# Altium schematic sheet GPIO_Ex.SchDoc
size A4; SheetNumber: 11; SheetTotal: 11
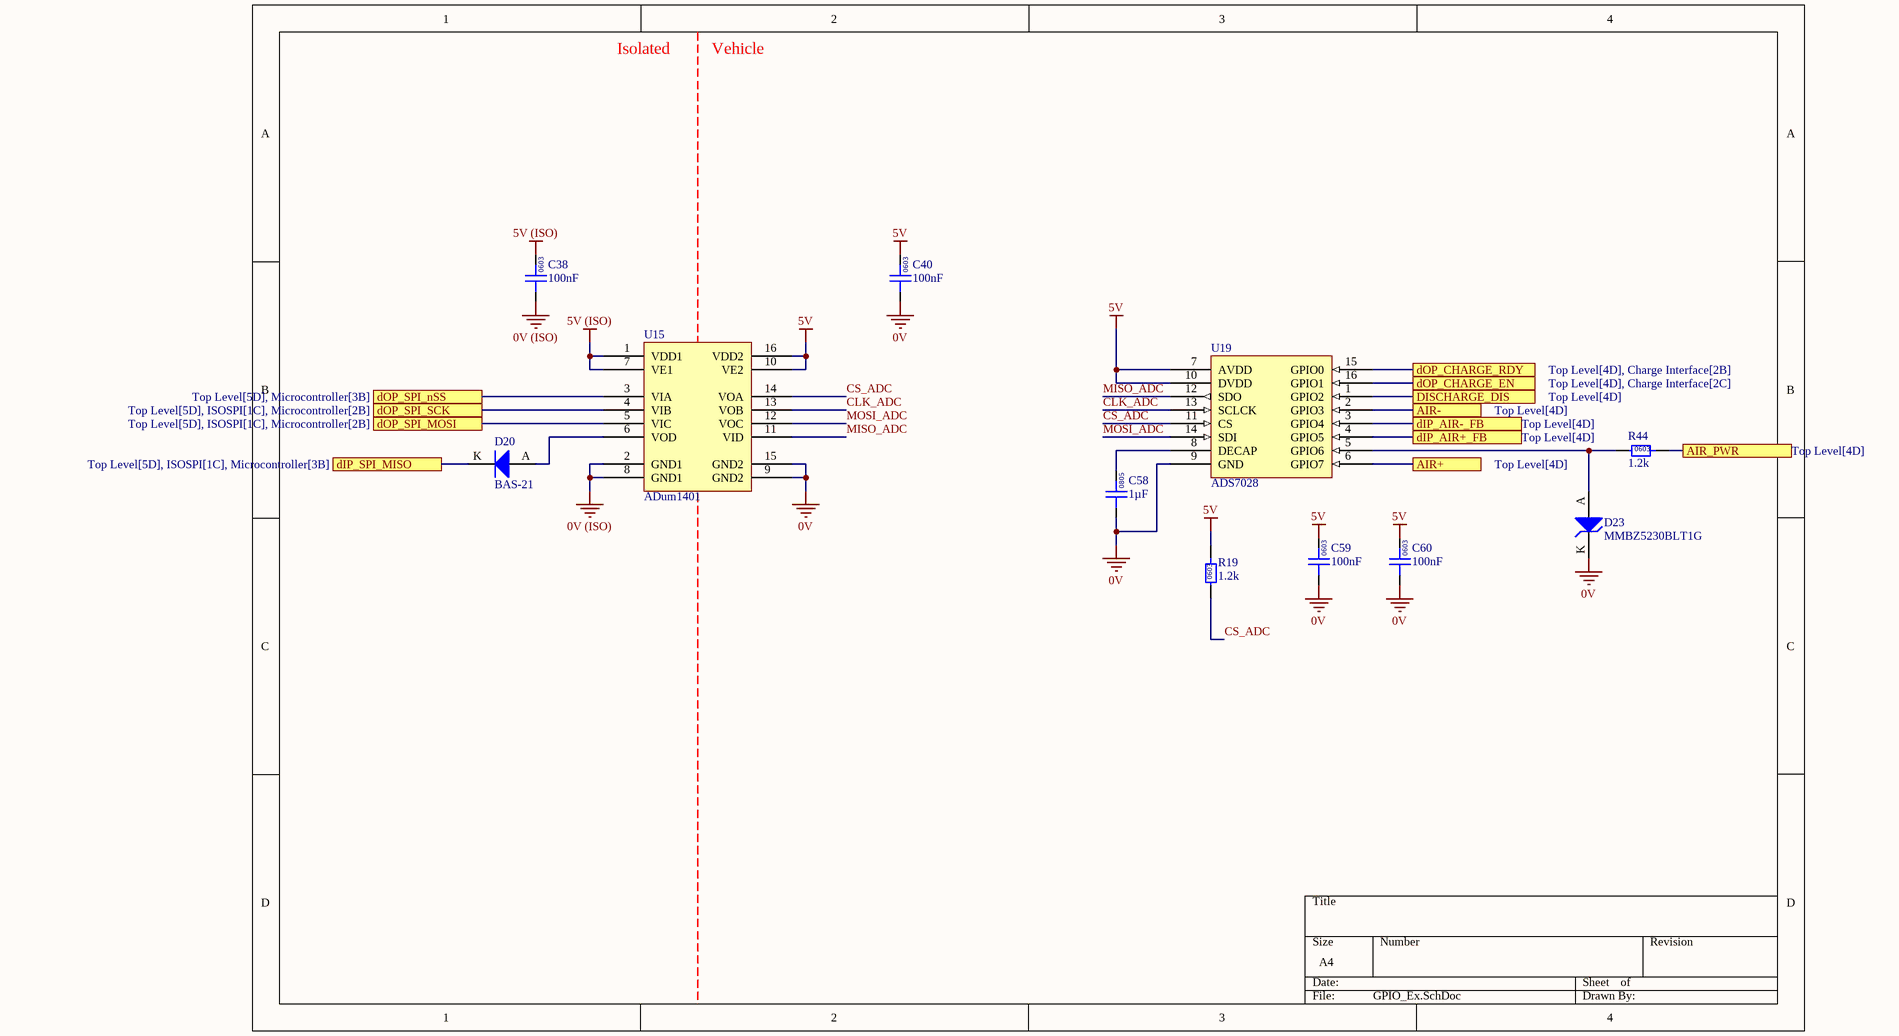
[diagram p0: GPIO_Ex.SchDoc]

## Parts
C38  100nF  [0603]
C40  100nF  [0603]
C58  1µF  [0805]
C59  100nF  [0603]
C60  100nF  [0603]
D20  BAS-21  [NEXPERIA_SOT23]
D23  MMBZ5230BLT1G  [NEXPERIA_SOT23]
R19  1.2k  [0603]
R44  1.2k  [0603]
U15  ADum1401  [AD 16-SOIC]
U19  ADS7028  [WFQN-16]

## Ports
AIR+ (see Top Level[4D]), AIR- (see Top Level[4D]), AIR_PWR (see Top Level[4D]), dIP_AIR+_FB (see Top Level[4D]), dIP_AIR-_FB (see Top Level[4D]), dIP_SPI_MISO (see Top Level[5D], ISOSPI[1C], Microcontroller[3B]), DISCHARGE_DIS (see Top Level[4D]), dOP_CHARGE_EN (see Top Level[4D], Charge Interface[2C]), dOP_CHARGE_RDY (see Top Level[4D], Charge Interface[2B]), dOP_SPI_MOSI (see Top Level[5D], ISOSPI[1C], Microcontroller[2B]), dOP_SPI_nSS (see Top Level[5D], Microcontroller[3B]), dOP_SPI_SCK (see Top Level[5D], ISOSPI[1C], Microcontroller[2B])

## Nets
0V: C40.1 C58.1 C59.1 C60.1 D23.K U15.9(GND2) U15.15(GND2) U19.9(GND)
0V (ISO): C38.1 U15.2(GND1) U15.8(GND1)
5V: C40.2 C59.2 C60.2 R19.2 U15.10(VE2) U15.16(VDD2) U19.7(AVDD) U19.10(DVDD)
5V (ISO): C38.2 U15.1(VDD1) U15.7(VE1)
AIR+: U19.6(GPIO7) ; port AIR+
AIR-: U19.2(GPIO3) ; port AIR-
AIR_PWR: R44.2 ; port AIR_PWR
CLK_ADC: U15.13(VOB) U19.13(SCLCK)
CS_ADC: R19.1 U15.14(VOA) U19.11(CS)
dIP_AIR+_FB: U19.4(GPIO5) ; port dIP_AIR+_FB
dIP_AIR-_FB: U19.3(GPIO4) ; port dIP_AIR-_FB
dIP_SPI_MISO: D20.K ; port dIP_SPI_MISO
DISCHARGE_DIS: U19.1(GPIO2) ; port DISCHARGE_DIS
dOP_CHARGE_EN: U19.16(GPIO1) ; port dOP_CHARGE_EN
dOP_CHARGE_RDY: U19.15(GPIO0) ; port dOP_CHARGE_RDY
dOP_SPI_MOSI: U15.5(VIC) ; port dOP_SPI_MOSI
dOP_SPI_nSS: U15.3(VIA) ; port dOP_SPI_nSS
dOP_SPI_SCK: U15.4(VIB) ; port dOP_SPI_SCK
MISO_ADC: U15.11(VID) U19.12(SDO)
MOSI_ADC: U15.12(VOC) U19.14(SDI)
NetC58_2: C58.2 U19.8(DECAP)
NetD20_A: D20.A U15.6(VOD)
NetD23_A: D23.A R44.1 U19.5(GPIO6)

## Notes on the sheet
- Isolated
- Vehicle
- (in symbol GCM21BR71H105KA03L) 0805
- (in symbol GCM188L81H104KA57D) 0603
- (in symbol RC0603JR-071K2L) 0603

## Library data of the parts
C38 C40 C59 C60 = GCM188L81H104KA57D: Manufacturer: muRata; Rated Voltage: 50V; Tolerance: ±10%; Material: MLCC; Temperature Rating: X8L; Part Number: GCM188L81H104KA57D; Value: 100nF; Digikey Part Number: 490-6049-1-ND
C58 = GCM21BR71H105KA03L: Manufacturer: muRata; Rated Voltage: 50V; Tolerance: ±10%; Material: MLCC; Temperature Rating: X7R; Part Number: GCM21BR71H105KA03L; Value: 1µF; Digikey Part Number: 490-10675-1-ND
D20 = BAS-21: Manufacturer: Nexperia USA Inc.; Forward Voltage: 1.0V; Breakdown Voltage: 250V; Rated Power: 250mW; Part Number: BAS-21
D23 = MMBZ5230BLT1G: Manufacturer: onsemi; Breakdown Voltage: 4.7V; Rated Power: 225mW; Part Number: MMBZ5230BLT1G; Digikey Part Number: MMBZ5230BLT1GOSTR-ND
R19 R44 = RC0603JR-071K2L: Manufacturer: YAGEO; Tolerance: 0.01; Rated Power: 0.1W; Part Number: RC0603JR-071K2L; Value: 1.2k; Material: FR-07; Digikey Part Number: 311-1.2KGRCT-ND
U15 = ADuM1401: General Purpose Digital Isolator 2500Vrms 4 Channel 1Mbps 25kV/µs CMTI 16-SOIC (0.295", 7.50mm Width); Manufacturer: Analog Devices; Complex IC: 0; Part Number: ADuM1401
U19 = ADS7028IRTER: IC ADC 12BIT SAR 16WQFN; Manufacturer: Texas Instruments; Part Number: ADS7028IRTER; Digikey Part Number: ADS7028IRTER; Digikey Link: https://www.digikey.com.au/en/products/detail/texas-instruments/ADS7028IRTER/12696020?s=N4IgTCBcDaIIIBEDKB2ADGAHASQEoBUBRXEAXQF8g